# EAGLE design design_god (EAGLE 8.6.0)

## Sheet 1 of 2
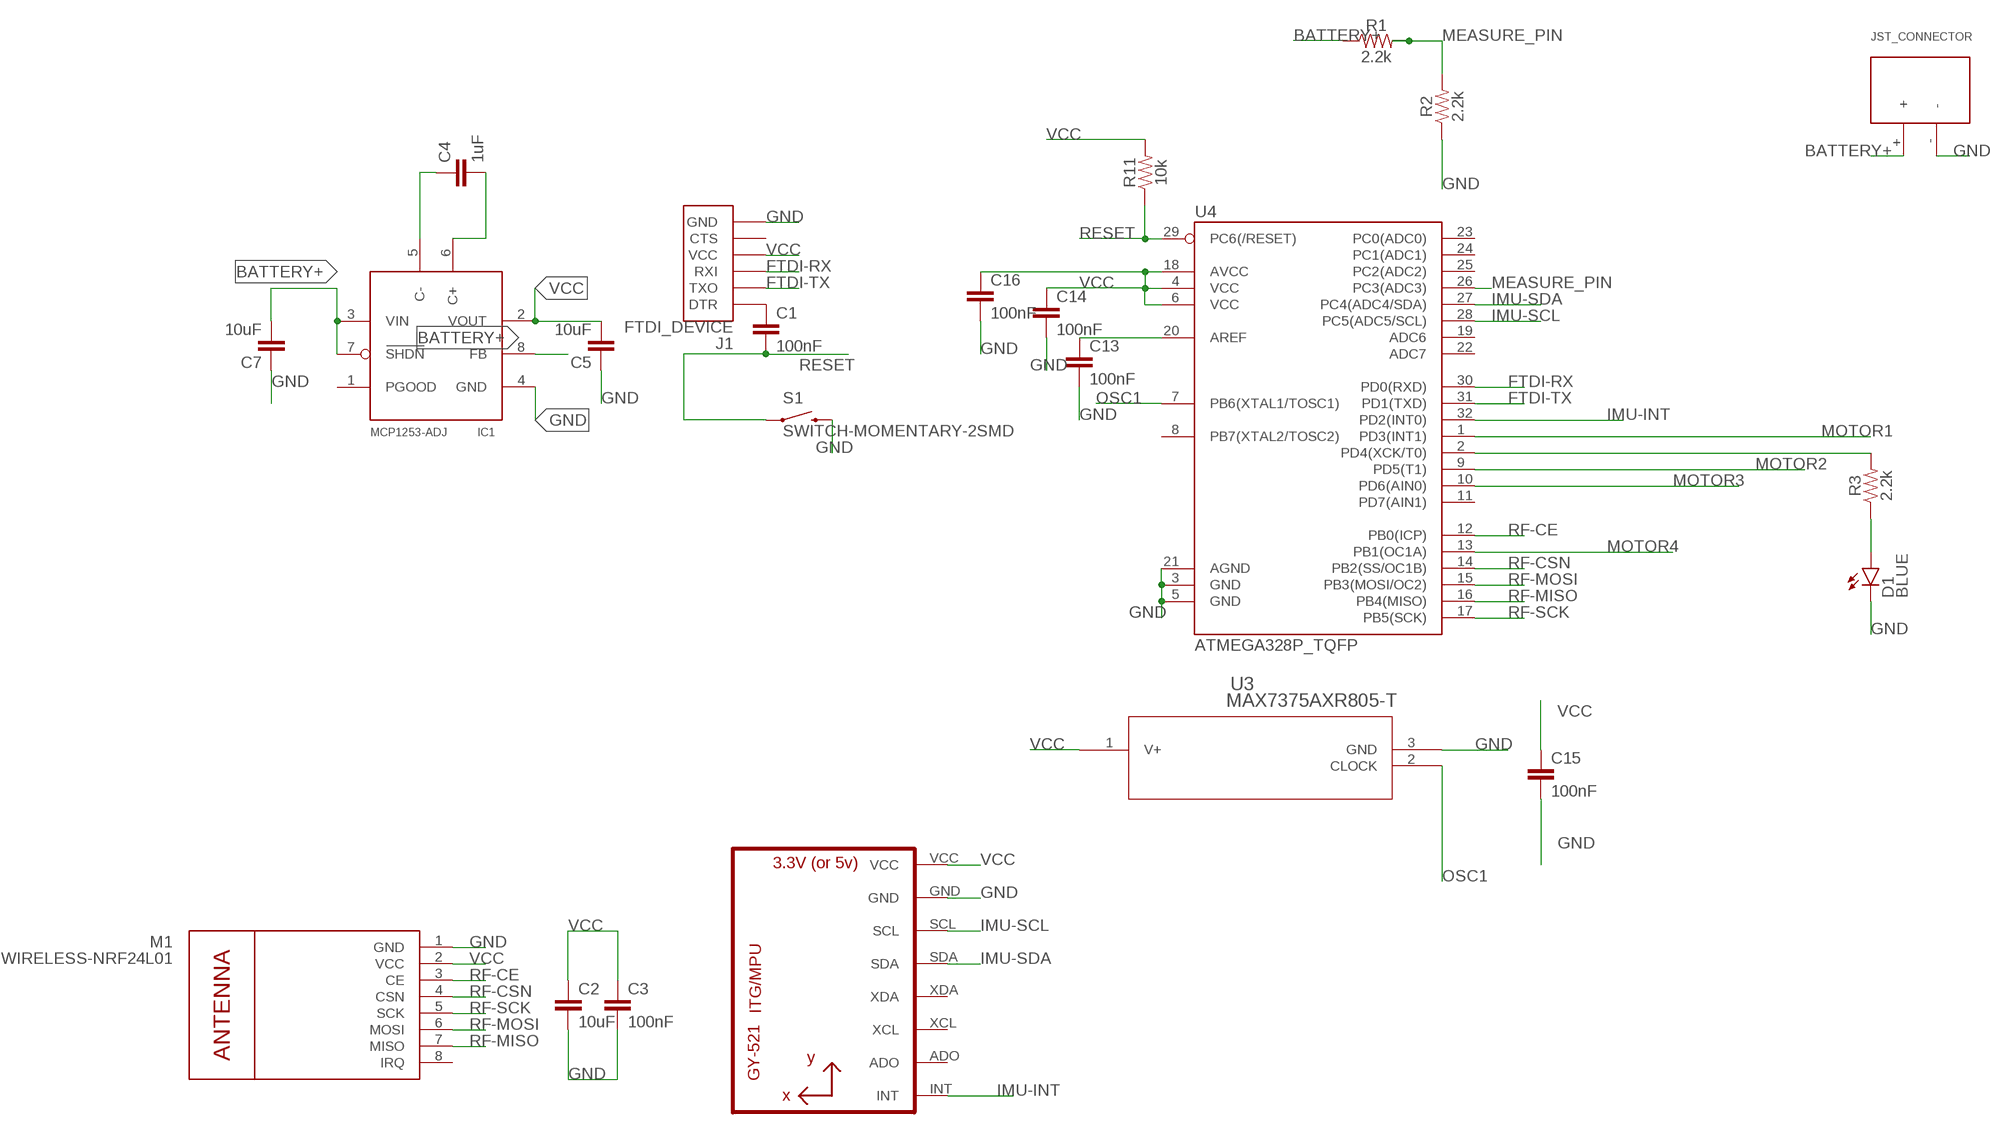
[diagram p0: schematic, sheet 1, part 1 of 2]
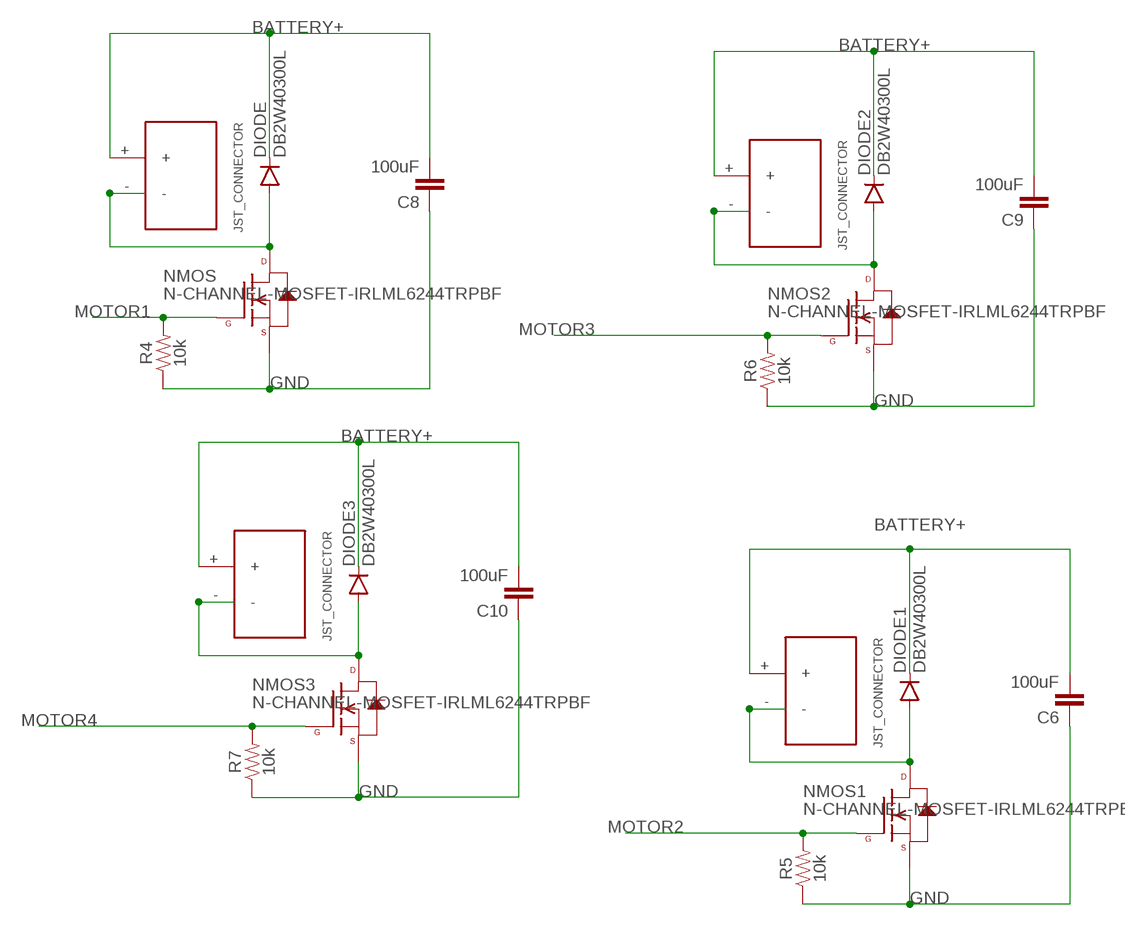
[diagram p1: schematic, sheet 1, part 2 of 2]

### Parts
C1  100nF  0.1UF-25V(+80/-20%)(0603)  [0603-CAP]
C2  10uF  CAP0603-CAP  [0603-CAP]
C3  100nF  CAP0603-CAP  [0603-CAP]
C4  1uF  0.1UF-25V(+80/-20%)(0603)  [0603-CAP]
C5  10uF  0.1UF-25V(+80/-20%)(0603)  [0603-CAP]
C6  100uF  CAP1206  [1206]
C7  10uF  0.1UF-25V(+80/-20%)(0603)  [0603-CAP]
C8  100uF  CAP1206  [1206]
C9  100uF  CAP1206  [1206]
C10  100uF  CAP1206  [1206]
C13  100nF  CAP0603-CAP  [0603-CAP]
C14  100nF  CAP0603-CAP  [0603-CAP]
C15  100nF  0.1UF-25V(+80/-20%)(0603)  [0603-CAP]
C16  100nF  CAP0603-CAP  [0603-CAP]
D1  BLUE  LED-BLUE0603  [LED-0603]
DIODE  DB2W40300L  [MINI2-F3-B]
DIODE1  DB2W40300L  [MINI2-F3-B]
DIODE2  DB2W40300L  [MINI2-F3-B]
DIODE3  DB2W40300L  [MINI2-F3-B]
IC1  MCP1253-ADJ  [MSOP8]
J1  FTDI_DEVICE  [FTDI_DEVICE_SIDE]
M1  WIRELESS-NRF24L01  [WIRELESS-NRF24L01]
MOTOR1  JST_CONNECTOR_FEMALE  [JST_CONNECTOR_FEMALE]
MOTOR2  JST_CONNECTOR_FEMALE  [JST_CONNECTOR_FEMALE]
MOTOR3  JST_CONNECTOR_FEMALE  [JST_CONNECTOR_FEMALE]
MOTOR4  JST_CONNECTOR_FEMALE  [JST_CONNECTOR_FEMALE]
NMOS  N-CHANNEL-MOSFET-IRLML6244TRPBF  [SOT23-3]
NMOS1  N-CHANNEL-MOSFET-IRLML6244TRPBF  [SOT23-3]
NMOS2  N-CHANNEL-MOSFET-IRLML6244TRPBF  [SOT23-3]
NMOS3  N-CHANNEL-MOSFET-IRLML6244TRPBF  [SOT23-3]
R1  2.2k  2.2KOHM-0603-1/10W-1%  [0603]
R2  2.2k  2.2KOHM-0603-1/10W-1%  [0603]
R3  2.2k  2.2KOHM-0603-1/10W-1%  [0603]
R4  10k  2.2KOHM-0603-1/10W-1%  [0603]
R5  10k  2.2KOHM-0603-1/10W-1%  [0603]
R6  10k  2.2KOHM-0603-1/10W-1%  [0603]
R7  10k  2.2KOHM-0603-1/10W-1%  [0603]
R11  10k  2.2KOHM-0603-1/10W-1%  [0603]
S1  SWITCH-MOMENTARY-2SMD  [TACTILE-SWITCH-SMD]
U2  GY-521MPU6050  [GY-521]
U3  MAX7375AXR805-T  [21-0075D]
U4  ATMEGA328P_TQFP  [TQFP32-08]
U$1  JST_CONNECTOR_FEMALE  [JST_CONNECTOR_FEMALE]

### Nets
BATTERY+: C6.2 C7.2 C8.2 C9.2 C10.2 DIODE1.NEG(GPIN) DIODE2.NEG(GPIN) DIODE3.NEG(GPIN) DIODE.NEG(GPIN) IC1.3(VIN) IC1.7(SHDN) IC1.8(FB) MOTOR1.+ MOTOR2.+ MOTOR3.+ MOTOR4.+ R1.1 U$1.+
FTDI-RX: J1.P$3(RXI) U4.30(PD0(RXD))
FTDI-TX: J1.P$2(TXO) U4.31(PD1(TXD))
GND: C2.2 C3.2 C5.1 C6.1 C7.1 C8.1 C9.1 C10.1 C13.2 C14.2 C15.2 C16.2 D1.C IC1.4(GND) J1.P$6(GND) M1.1(GND) NMOS1.2(S) NMOS2.2(S) NMOS3.2(S) NMOS.2(S) R2.1 R4.1 R5.1 R6.1 R7.1 S1.3 U2.GND U3.3(GND) U4.3(GND) U4.5(GND) U4.21(AGND) U$1.-
IMU-INT: U2.INT U4.32(PD2(INT0))
IMU-SCL: U2.SCL U4.28(PC5(ADC5/SCL))
IMU-SDA: U2.SDA U4.27(PC4(ADC4/SDA))
MEASURE_PIN: R1.2 R2.2 U4.26(PC3(ADC3))
MOTOR1: NMOS.1(G) R4.2 U4.1(PD3(INT1))
MOTOR2: NMOS1.1(G) R5.2 U4.9(PD5(T1))
MOTOR3: NMOS2.1(G) R6.2 U4.10(PD6(AIN0))
MOTOR4: NMOS3.1(G) R7.2 U4.13(PB1(OC1A))
N$1: R3.2 U4.2(PD4(XCK/T0))
N$2: C1.1 J1.P$1(DTR)
N$4: DIODE1.POS(PPIN) MOTOR2.- NMOS1.3(D)
N$5: DIODE2.POS(PPIN) MOTOR3.- NMOS2.3(D)
N$6: DIODE.POS(PPIN) MOTOR1.- NMOS.3(D)
N$7: DIODE3.POS(PPIN) MOTOR4.- NMOS3.3(D)
N$8: C4.1 IC1.5(C-)
N$9: C4.2 IC1.6(C+)
N$11: D1.A R3.1
N$15: C13.1 U4.20(AREF)
OSC1: U3.2(CLOCK) U4.7(PB6(XTAL1/TOSC1))
RESET: C1.2 R11.1 S1.1 U4.29(PC6(/RESET))
RF-CE: M1.3(CE) U4.12(PB0(ICP))
RF-CSN: M1.4(CSN) U4.14(PB2(SS/OC1B))
RF-MISO: M1.7(MISO) U4.16(PB4(MISO))
RF-MOSI: M1.6(MOSI) U4.15(PB3(MOSI/OC2))
RF-SCK: M1.5(SCK) U4.17(PB5(SCK))
VCC: C2.1 C3.1 C5.2 C14.1 C15.1 C16.1 IC1.2(VOUT) J1.P$4(VCC) M1.2(VCC) R11.2 U2.VCC U3.1(V+) U4.4(VCC) U4.6(VCC) U4.18(AVCC)
Unconnected: IC1.1(PGOOD) J1.P$5(CTS) M1.8(IRQ) U2.ADO U2.XCL U2.XDA U4.8(PB7(XTAL2/TOSC2)) U4.11(PD7(AIN1)) U4.19(ADC6) U4.22(ADC7) U4.23(PC0(ADC0)) U4.24(PC1(ADC1)) U4.25(PC2(ADC2))

## Sheet 2 of 2

## Library data of the parts
C1 C4 C5 C7 C15 = SparkFun-Capacitors:0.1UF-25V(+80/-20%)(0603): CAP-00810 Ceramic Standard decoupling cap; PROD_ID: CAP-00810; VALUE: 0.1uF
C2 C3 C6 C8-C10 C13 C14 C16 = SparkFun-Passives:CAP: Capacitor Standard 0603 ceramic capacitor, and 0.1" leaded capacitor.
D1 = LEDs:LED-BLUE: Blue LEDs for production use Various blue LEDs stocked by SparkFun production 0603 - DIO-08575 Rebel - DIO-09553 1206 - DIO-09911; PROD_ID: DIO-08575; SPICEPREFIX: D
DIODE DIODE1-DIODE3 = quad:DB2W40300L
IC1 = microchip:MCP1253-ADJ: 1MHz Adjustable Switching Regulator
J1 = quad:FTDI_DEVICE: Connector which mates to FTDI basic or FTDI cable.
M1 = quad:WIRELESS-NRF24L01: 2.4 GHz Wireless Module based on NRF24L01 chip
MOTOR1-MOTOR4 U$1 = quad:JST_CONNECTOR_FEMALE
NMOS NMOS1-NMOS3 = quad:N-CHANNEL-MOSFET: N-Channel MOSFET Mode Field Effect Transistor; DATASHEET: http://www.mouser.com/ds/2/196/irlml6244pbf-936666.pdf; MOUSER: 942-IRLML6244TRPBF; URL: http://www.mouser.com/Search/ProductDetail.aspx?R=IRLML6244TRPBFvirtualkey57370000virtualkey942-IRLML6244TRPBF
R1 R2 = SparkFun-Resistors:2.2KOHM: 2.2kΩ resistor A resistor is a passive two-terminal electrical component that implements electrical resistance as a circuit element. Resistors act to reduce current flow, and, at the same time, act to lower voltage levels within circuits. - Wikipedia; PROD_ID: RES-08272
R3 = SparkFun-Resistors:2.2KOHM: 2.2kΩ resistor A resistor is a passive two-terminal electrical component that implements electrical resistance as a circuit element. Resistors act to reduce current flow, and, at the same time, act to lower voltage levels within circuits. - Wikipedia; PROD_ID: RES-08272; SPICEPREFIX: R
R4-R7 R11 = SparkFun-Resistors:2.2KOHM: 2.2kΩ resistor A resistor is a passive two-terminal electrical component that implements electrical resistance as a circuit element. Resistors act to reduce current flow, and, at the same time, act to lower voltage levels within circuits. - Wikipedia; PROD_ID: RES-08272; VALUE: 2.2k
S1 = quad:SWITCH-MOMENTARY-2: Various NO switches- pushbuttons, reed, etc; PROD_ID: SWCH-08247
U2 = quad:GY-521
U3 = MAX7375AXR805-T:MAX7375AXR805-T; AVAILABILITY: Good; DESCRIPTION: OSCILLATOR MEMS 8MHZ CMOS SMD; MF: Maxim Integrated; MP: MAX7375AXR805+T; PACKAGE: SC-70 Maxim Integrated; PRICE: 1.06 USD
U4 = quad:ATMEGA328P_TQFP; PROD_ID: IC-09069

## Board
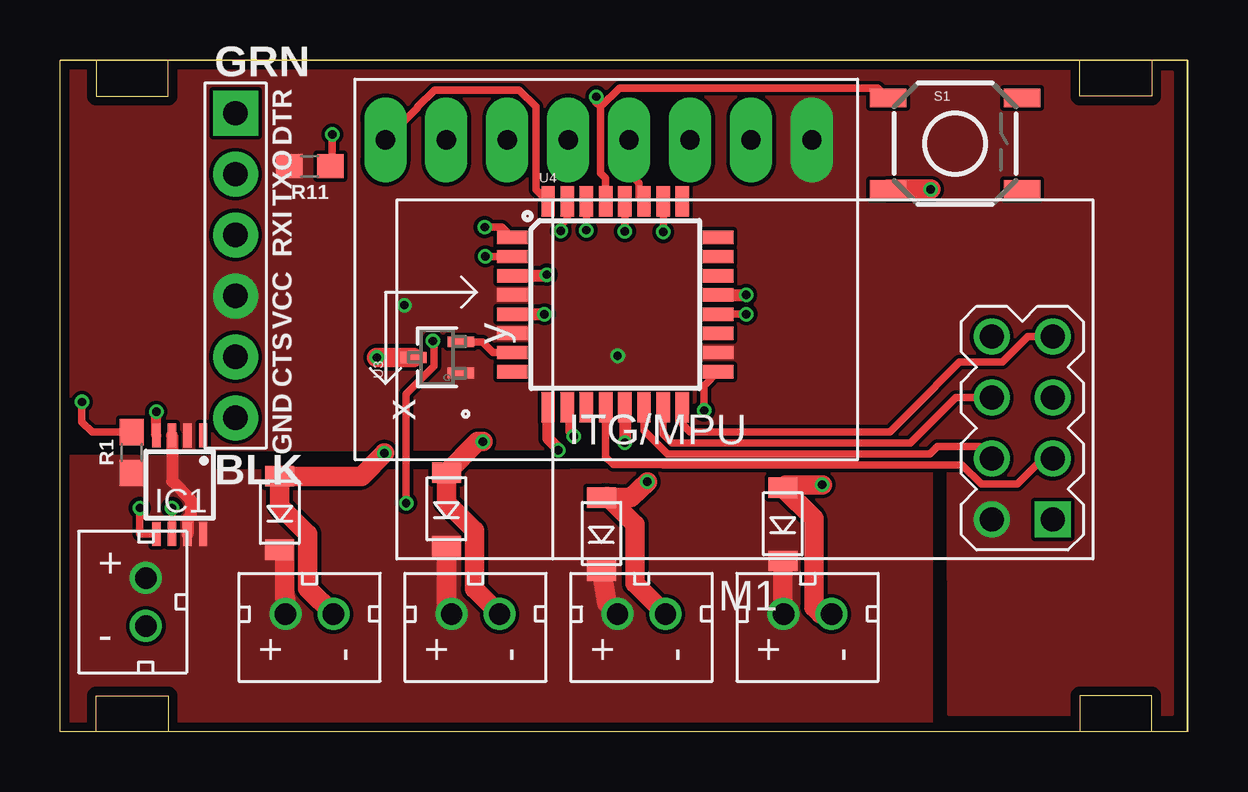
[diagram p2: board, top side]
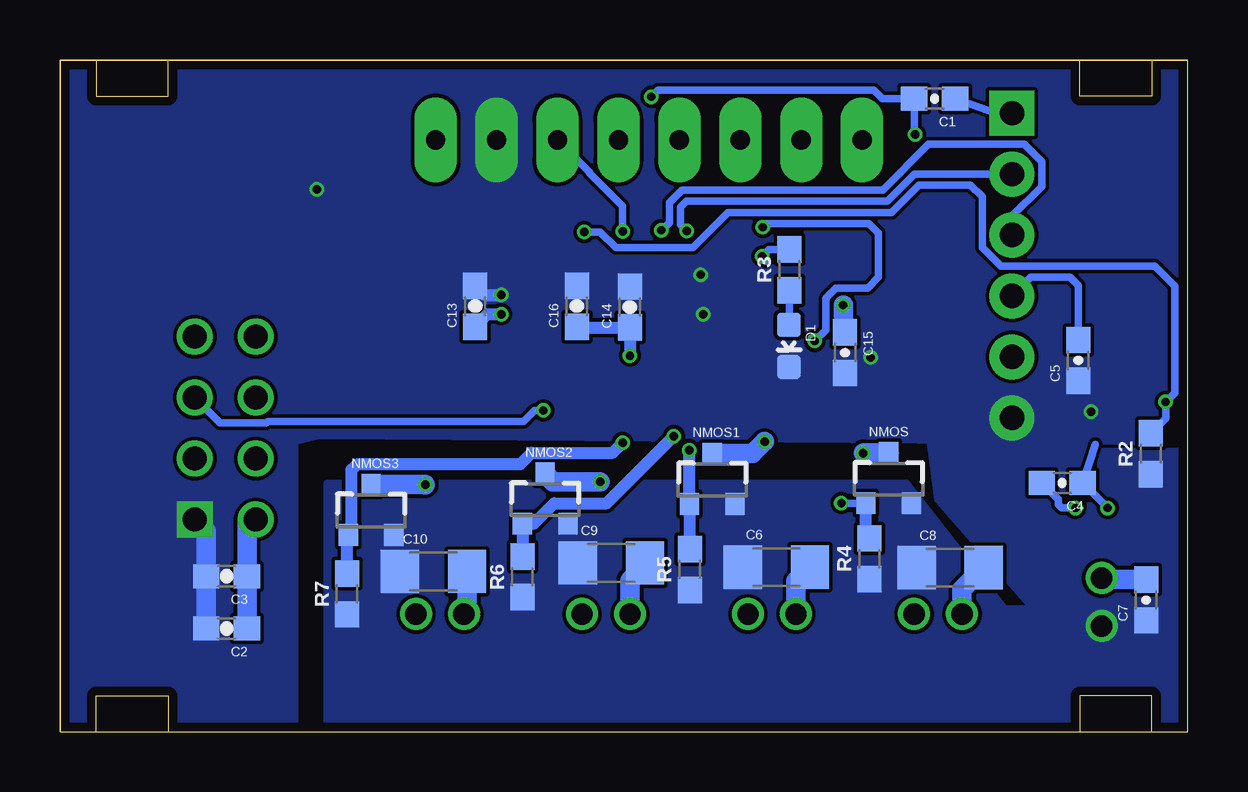
[diagram p3: board, bottom side, seen from below]

Size 47 x 28 mm. Coordinates in mm from the lower left corner, seen from the top.
Outline: 46.99,0 47,0 47,28 45.5,28
Outline: 46.99,0 46.99,27.98 0,27.98
Outline: 0,27.98 0,28 1.5,28
Outline: 0,27.98 0,0 1.5,0
Outline: 1.5,28 4.5,28
Outline: 4.5,28 42.5,28
Outline: 42.5,28 45.5,28
Outline: 46.99,0 45.5,0
Outline: 45.5,0 42.5,0
Outline: 42.5,0 4.5,0
Outline: 4.5,0 1.5,0
Outline: 1.5,0 1.5,1.5 4.5,1.5 4.5,0
Outline: 1.5,28 1.5,26.5 4.5,26.5 4.5,28
Outline: 45.5,28 45.5,26.5 42.5,26.5 42.5,28
Outline: 45.5,0 45.5,1.5 42.5,1.5 42.5,0
Copper layers (1*16): Top 0.035559375mm / dielectric 1.6mm / Bottom 0.035559375mm
Design rules "oshpark-2layer": minimum track width 6mil, minimum drill 10mil, track to track 6mil, track to pad 6mil, pad to pad 6mil, via to via 6mil, smd to smd 6mil, copper to edge 15mil, drill to drill 6mil, minimum pad ring 5mil, minimum via ring 5mil, stop-mask expansion 2.5mil, vias tented up to drill 0mil, thermal gap 10mil

### Footprints (pad centres in the part's own frame; a part is rotated, then mirrored left to right if it is on the bottom)
0603-CAP = smd 1.1 x 1: 1 -0.85,0; 2 0.85,0
1206 = smd 1.6 x 1.8: 1 -1.4,0; 2 1.4,0
LED-0603 = smd 1 x 1: A 0,-0.877; C 0,0.877
MINI2-F3-B = smd 1.22 x 0.85: NEG 0,1.55; POS 0,-1.5
MSOP8 = smd 0.35 x 1: 1 -0.975,-2.05; 2 -0.325,-2.05; 3 0.325,-2.05; 4 0.975,-2.05; 5 0.975,2.05; 6 0.325,2.05; 7 -0.325,2.05; 8 -0.975,2.05
FTDI_DEVICE_SIDE = drill 1.016 pad 1.88 square: P$1 -6.35,0 | drill 1.016 pad 1.88: P$2 -3.81,0; P$3 -1.27,0; P$4 1.27,0; P$5 3.81,0; P$6 6.35,0
WIRELESS-NRF24L01 = drill 1 square: 1 -12.7,6.35 | drill 1: 2 -10.16,6.35; 3 -12.7,3.81; 4 -10.16,3.81; 5 -12.7,1.27; 6 -10.16,1.27; 7 -12.7,-1.27; 8 -10.16,-1.27
JST_CONNECTOR_FEMALE = drill 0.889: + 0,1; - 0,-1
SOT23-3 = smd 0.8 x 0.9: 1 -0.95,-1; 2 0.95,-1; 3 0,1.1
0603 = smd 1.1 x 1: 1 -0.85,0; 2 0.85,0
TACTILE-SWITCH-SMD = smd 1.524 x 0.762: 1 -2.794,1.905; 2 2.794,1.905; 3 -2.794,-1.905; 4 2.794,-1.905
GY-521 = drill 0.8 pad 1.778 long: ADO -8.89,-6.35; GND -8.89,6.35; INT -8.89,-8.89; SCL -8.89,3.81; SDA -8.89,1.27; VCC -8.89,8.89; XCL -8.89,-3.81; XDA -8.89,-1.27
21-0075D = smd 0.457 x 1.118: 1 -0.65,-0.991; 2 0.65,-0.991; 3 0,0.991
TQFP32-08 = smd 1.27 x 0.559: 1 -4.293,2.8; 2 -4.293,2; 3 -4.293,1.2; 4 -4.293,0.4; 5 -4.293,-0.4; 6 -4.293,-1.2; 7 -4.293,-2; 8 -4.293,-2.8; 17 4.293,-2.8; 18 4.293,-2; 19 4.293,-1.2; 20 4.293,-0.4; 21 4.293,0.4; 22 4.293,1.2; 23 4.293,2; 24 4.293,2.8 | smd 0.559 x 1.27: 9 -2.8,-4.293; 10 -2,-4.293; 11 -1.2,-4.293; 12 -0.4,-4.293; 13 0.4,-4.293; 14 1.2,-4.293; 15 2,-4.293; 16 2.8,-4.293; 25 2.8,4.293; 26 2,4.293; 27 1.2,4.293; 28 0.4,4.293; 29 -0.4,4.293; 30 -1.2,4.293; 31 -2,4.293; 32 -2.8,4.293

### Placement (x,y rotation side)
C1  10.54,26.39 180 bottom
C2  40.06,4.29 180 bottom
C3  40.06,6.48 180 bottom
C4  5.22,10.37 180 bottom
C5  4.55,15.47 90 bottom
C6  17.14,6.86 0 bottom
C7  1.73,5.49 90 bottom
C8  9.9,6.83 0 bottom
C9  24.01,7.04 0 bottom
C10  31.43,6.68 0 bottom
C13  29.69,17.73 90 bottom
C14  23.24,17.7 90 bottom
C15  14.27,15.8 270 bottom
C16  25.45,17.73 90 bottom
D1  16.61,16.08 180 bottom
DIODE  9.16,9.14 180 top
DIODE1  16.11,9.29 180 top
DIODE2  22.57,8.25 180 top
DIODE3  30.13,8.66 180 top
IC1  4.99,10.29 180 top
J1  7.32,19.43 270 top
M1  28.68,15.19 180 top
MOTOR1  10.4,4.9 90 top
MOTOR2  17.32,4.9 90 top
MOTOR3  24.24,4.9 90 top
MOTOR4  31.16,4.9 90 top
NMOS  12.46,10.52 0 bottom
NMOS1  19.81,10.49 0 bottom
NMOS2  26.78,9.66 0 bottom
NMOS3  34.03,9.2 0 bottom
R1  3,11.63 90 top
R2  1.52,11.58 90 bottom
R3  16.59,19.25 90 bottom
R4  13.25,7.2 90 bottom
R5  20.75,6.75 90 bottom
R6  27.72,6.45 90 bottom
R7  35.03,5.74 90 bottom
R11  10.41,23.57 180 top
S1  37.31,24.51 0 top
U2  22.45,15.77 270 top
U3  15.72,15.6 90 top
U4  23.14,17.8 0 top
U$1  3.58,5.4 0 top

### Tracks (layer width: path | path; a pad name or v marks a point on that pad's centre or on a via)
BATTERY+
  Top 0.508: IC1.3 4.67,10.44 5.46,9.65 5.46,9 5.32,8.86 IC1.7
  Top 0.813: DIODE1.NEG 16.11,5.11 MOTOR2.+ | DIODE2.NEG 22.8,5.34 MOTOR3.+ 23.24,4.67 | DIODE3.NEG 30.13,4.93 MOTOR4.+ | MOTOR1.+ 9.4,5.54 9.36,5.57 9.36,7.39 DIODE.NEG
  Bottom 0.813: C7.2 3.52,6.33 U$1.+ | C8.2 9.4,5.93 MOTOR1.+ | C6.2 16.32,6.28 MOTOR2.+ | C9.2 23.24,6.31 MOTOR3.+ | C10.2 30.03,5.03 MOTOR4.+
  pour Top (no thermals): 0.18,11.48 6.35,11.46 6.22,10.87 36.32,10.9 36.32,0.13 0.05,0.13
FTDI-RX  (via drill 0.35)
  Top 0.305: v21.95,20.9 U4.30
  Bottom 0.305: J1.P$3 7.32,21.48 6.07,22.73 6.07,23.76 6.8,24.49 10.79,24.49 12.7,22.58 21.07,22.58 21.59,22.06 21.59,21.21 21.95,20.85 v21.95,20.9
FTDI-TX  (via drill 0.35)
  Top 0.305: v20.88,20.88 20.88,21.11 21.16,21.39 21.14,21.4 U4.31
  Bottom 0.305: J1.P$2 11.39,23.24 12.51,22.12 20.88,22.12 21.13,21.87 21.13,21.13 v20.88,20.88
GND  (via drill 0.35)
  Top 0.406: IC1.4 4.02,13.13 4.01,13.18 v4.01,13.34
  Top 0.508: U4.21 v28.61,18.2 | U4.5 20.14,17.4 v20.19,17.4 | U4.3 20.15,19 20.19,19.05 v20.3,19.05
  Top 0.813: S1.3 36.2,22.61 36.22,22.58 36.25,22.61 v36.3,22.61 | U3.3 13.26,15.6 v13.21,15.6
  Bottom 0.508: 29.72,18.61 C13.2 29.32,18.2 v28.61,18.2
  Bottom 0.813: 7.32,13.33 J1.P$6 | M1.1 40.91,8.37 C3.2 C2.2
  pour Bottom (no thermals): 0.25,27.84 46.74,28.12 46.74,0.41 37.13,0.41 37.13,12.04 36.22,12.27 0.15,11.99
  pour Bottom (no thermals): -0.33,11.68 3.63,11.68 3.63,15.57 11.18,15.57 10.41,9.68 6.43,5.13 7.65,5.11 11.71,10.34 35.86,10.34 35.86,-0.43 -0.33,-0.43
IMU-INT
  Top 0.305: U2.INT 14.91,26.01 14.91,26.05 15.61,26.75 19.14,26.75 19.84,26.05 19.84,22.6 U4.32
IMU-SCL  (via drill 0.35)
  Top 0.305: v23.55,20.85 v23.54,20.86 U4.28
  Bottom 0.305: U2.SCL 24.92,23.32 24.92,23.28 23.55,21.91 v23.55,20.85 23.55,20.83
IMU-SDA
  Top 0.305: U4.27 24.13,22.31 24.13,22.86 23.72,23.26 U2.SDA
MEASURE_PIN  (via drill 0.35)
  Top 0.305: v25.15,20.83 U4.26 | R1.2 1.33,12.48 0.91,12.9 v0.91,13.74
  Bottom 0.305: v25.15,20.83 24.49,20.83 23.83,20.17 20.62,20.17 19.15,21.64 12.35,21.64 11.2,22.78 9.04,22.78 8.56,22.3 8.56,20.18 7.78,19.41 1.37,19.41 0.53,18.57 0.53,14.12 v0.91,13.74 0.91,13.04 R2.2
MOTOR1  (via drill 0.35)
  Top 0.305: v14.43,9.53 14.43,14.08 15.59,15.24 15.59,15.95 15.6,15.95 15.6,16.23 v15.54,16.28 | v17.7,21.03 18.42,21.03 U4.1
  Bottom 0.305: NMOS.1 14.42,9.52 v14.43,9.53 | 15.67,16.41 v15.54,16.28 15.08,16.75 15.08,18.07 14.65,18.5 13.33,18.5 12.88,18.95 12.88,20.78 13.28,21.18 17.55,21.18 v17.7,21.03
  Bottom 0.508: R4.2 13.41,8.21 NMOS.1
MOTOR2  (via drill 0.35)
  Top 0.508: U4.9 20.34,12.22 20.78,11.79 v20.78,11.73
  Bottom 0.305: 20.75,9.48 NMOS1.1
  Bottom 0.508: R5.2 20.76,7.61 NMOS1.1 20.78,9.51 v20.78,11.73
MOTOR3  (via drill 0.35)
  Top 0.305: U4.10 21.22,13.3 21.22,12.51 v21.41,12.32
  Bottom 0.508: v21.41,12.32 24.21,9.52 26.4,9.52 27.25,8.66 NMOS2.1 R6.2
MOTOR4  (via drill 0.35)
  Top 0.508: U4.13 v23.54,12.04 v23.55,12.04
  Bottom 0.508: R7.2 35.03,8.15 NMOS3.1 34.84,8.34 34.84,10.91 34.6,11.15 27.81,11.15 27.35,11.62 23.97,11.62 v23.55,12.04
N$1  (via drill 0.35)
  Top 0.305: v17.73,19.81 v17.74,19.8 U4.2
  Bottom 0.305: 17.59,19.62 17.6,19.61 17.73,19.74 v17.73,19.81 17.44,20.1 R3.2
N$2
  Bottom 0.305: J1.P$1 7.99,25.78 C1.1
N$4  (via drill 0.35)
  Top 0.813: MOTOR2.- 17.28,5.94 17.28,8.39 16.11,9.56 DIODE1.POS 17.42,12.09 v17.63,12.09
  Bottom 0.813: v17.63,12.09 18.13,11.59 NMOS1.3
N$5  (via drill 0.35)
  Top 0.813: MOTOR3.- 23.97,6.17 23.97,8.63 22.8,9.8 DIODE2.POS 23.8,9.75 v24.49,10.41
  Bottom 0.813: v24.49,10.41 26.46,10.41 NMOS2.3
N$6  (via drill 0.35)
  Top 0.813: MOTOR1.- 10.33,5.97 10.33,8.25 9.16,9.42 DIODE.POS 12.57,10.64 13.54,11.61 v13.51,11.61
  Bottom 0.305: 12.18,11.62 NMOS.3
  Bottom 0.813: v13.51,11.61 v13.5,11.62 NMOS.3
N$7  (via drill 0.35)
  Top 0.813: MOTOR4.- 31.7,4.9 31.42,5.18 31.42,8.88 DIODE3.POS 30.26,10.29 v31.77,10.29
  Bottom 0.813: NMOS3.3 v31.79,10.3 v31.77,10.29
N$8  (via drill 0.35)
  Top 0.305: IC1.5 3.33,8.24 v3.33,9.32 3.33,9.35
  Bottom 0.305: 3.84,11.96 C4.1 v3.33,9.32
N$9  (via drill 0.35)
  Top 0.305: v4.67,9.32 IC1.6
  Bottom 0.305: C4.2 5.38,9.68 5.38,9.47 5.23,9.32 v4.67,9.32
N$11
  Bottom 0.305: R3.1 16.59,16.98 D1.A
N$15  (via drill 0.35)
  Top 0.305: U4.20 v28.61,17.4
  Bottom 0.508: C13.1 29.17,17.4 v28.61,17.4
OSC1
  Top 0.305: U3.2 17.61,16.25 18.06,15.8 U4.7
RESET  (via drill 0.35)
  Top 0.305: S1.1 34.1,26.83 23.32,26.83 22.53,26.05 | 22.53,26.05 22.53,23.28 22.74,23.07 U4.29 | R11.1 arc90 11.35,23.66 v11.35,24.89 | v22.35,26.47 22.35,26.23 22.53,26.05
  Bottom 0.305: v11.35,24.89 arc90 11.39,24.93 C1.2 12.71,26.39 13.07,26.75 22.07,26.75 v22.35,26.47
RF-CE
  Top 0.305: U4.12 22.74,11.45 23.06,11.12 25.13,11.12 37.6,11.12 38.4,10.32 39.91,10.32 40.97,11.38 M1.3
RF-CSN
  Top 0.305: U4.14 24.34,12.56 25.32,11.58 36.27,11.58 36.58,11.89 38.33,11.89 M1.4
RF-MISO
  Top 0.305: U4.16 25.94,12.82 26.27,12.49 34.59,12.49 35.53,13.44 | 35.53,13.44 35.61,13.51 | 35.53,13.44 37.5,15.4 39.27,15.4 40.33,16.46 M1.7
RF-MOSI
  Top 0.305: U4.15 25.14,12.4 25.51,12.04 35.46,12.04 37.34,13.92 M1.6
RF-SCK  (via drill 0.35)
  Top 0.305: U4.17 26.85,14.41 v26.85,13.39
  Bottom 0.305: v26.85,13.39 27.23,13.39 27.69,12.93 38.33,12.93 38.4,12.86 40.32,12.86 M1.5
VCC  (via drill 0.35)
  Bottom 0.305: C5.2 4.55,18.59 4.9,18.95 6.53,18.95 J1.P$4
  Bottom 0.508: C16.1 25.43,16.85 C14.1 v23.24,15.67
  Bottom 0.813: C15.1 14.33,16.7 v14.35,17.78 | M1.2 39.21,8.84 C3.1 C2.1
  pour Top (no thermals): -0.03,27.71 -0.08,11.91 8.48,11.73 37.03,11.86 37.06,0.71 46.35,0.71 46.35,27.48